# EAGLE design new_boardforfirebot (EAGLE 9.6.2)
AUTHOR: Brooks & Dorosk; BOARD_NAME: Final Board; DOC_NUM: 1; PROJECT_NAME: Fire Bot; REVISION: 2
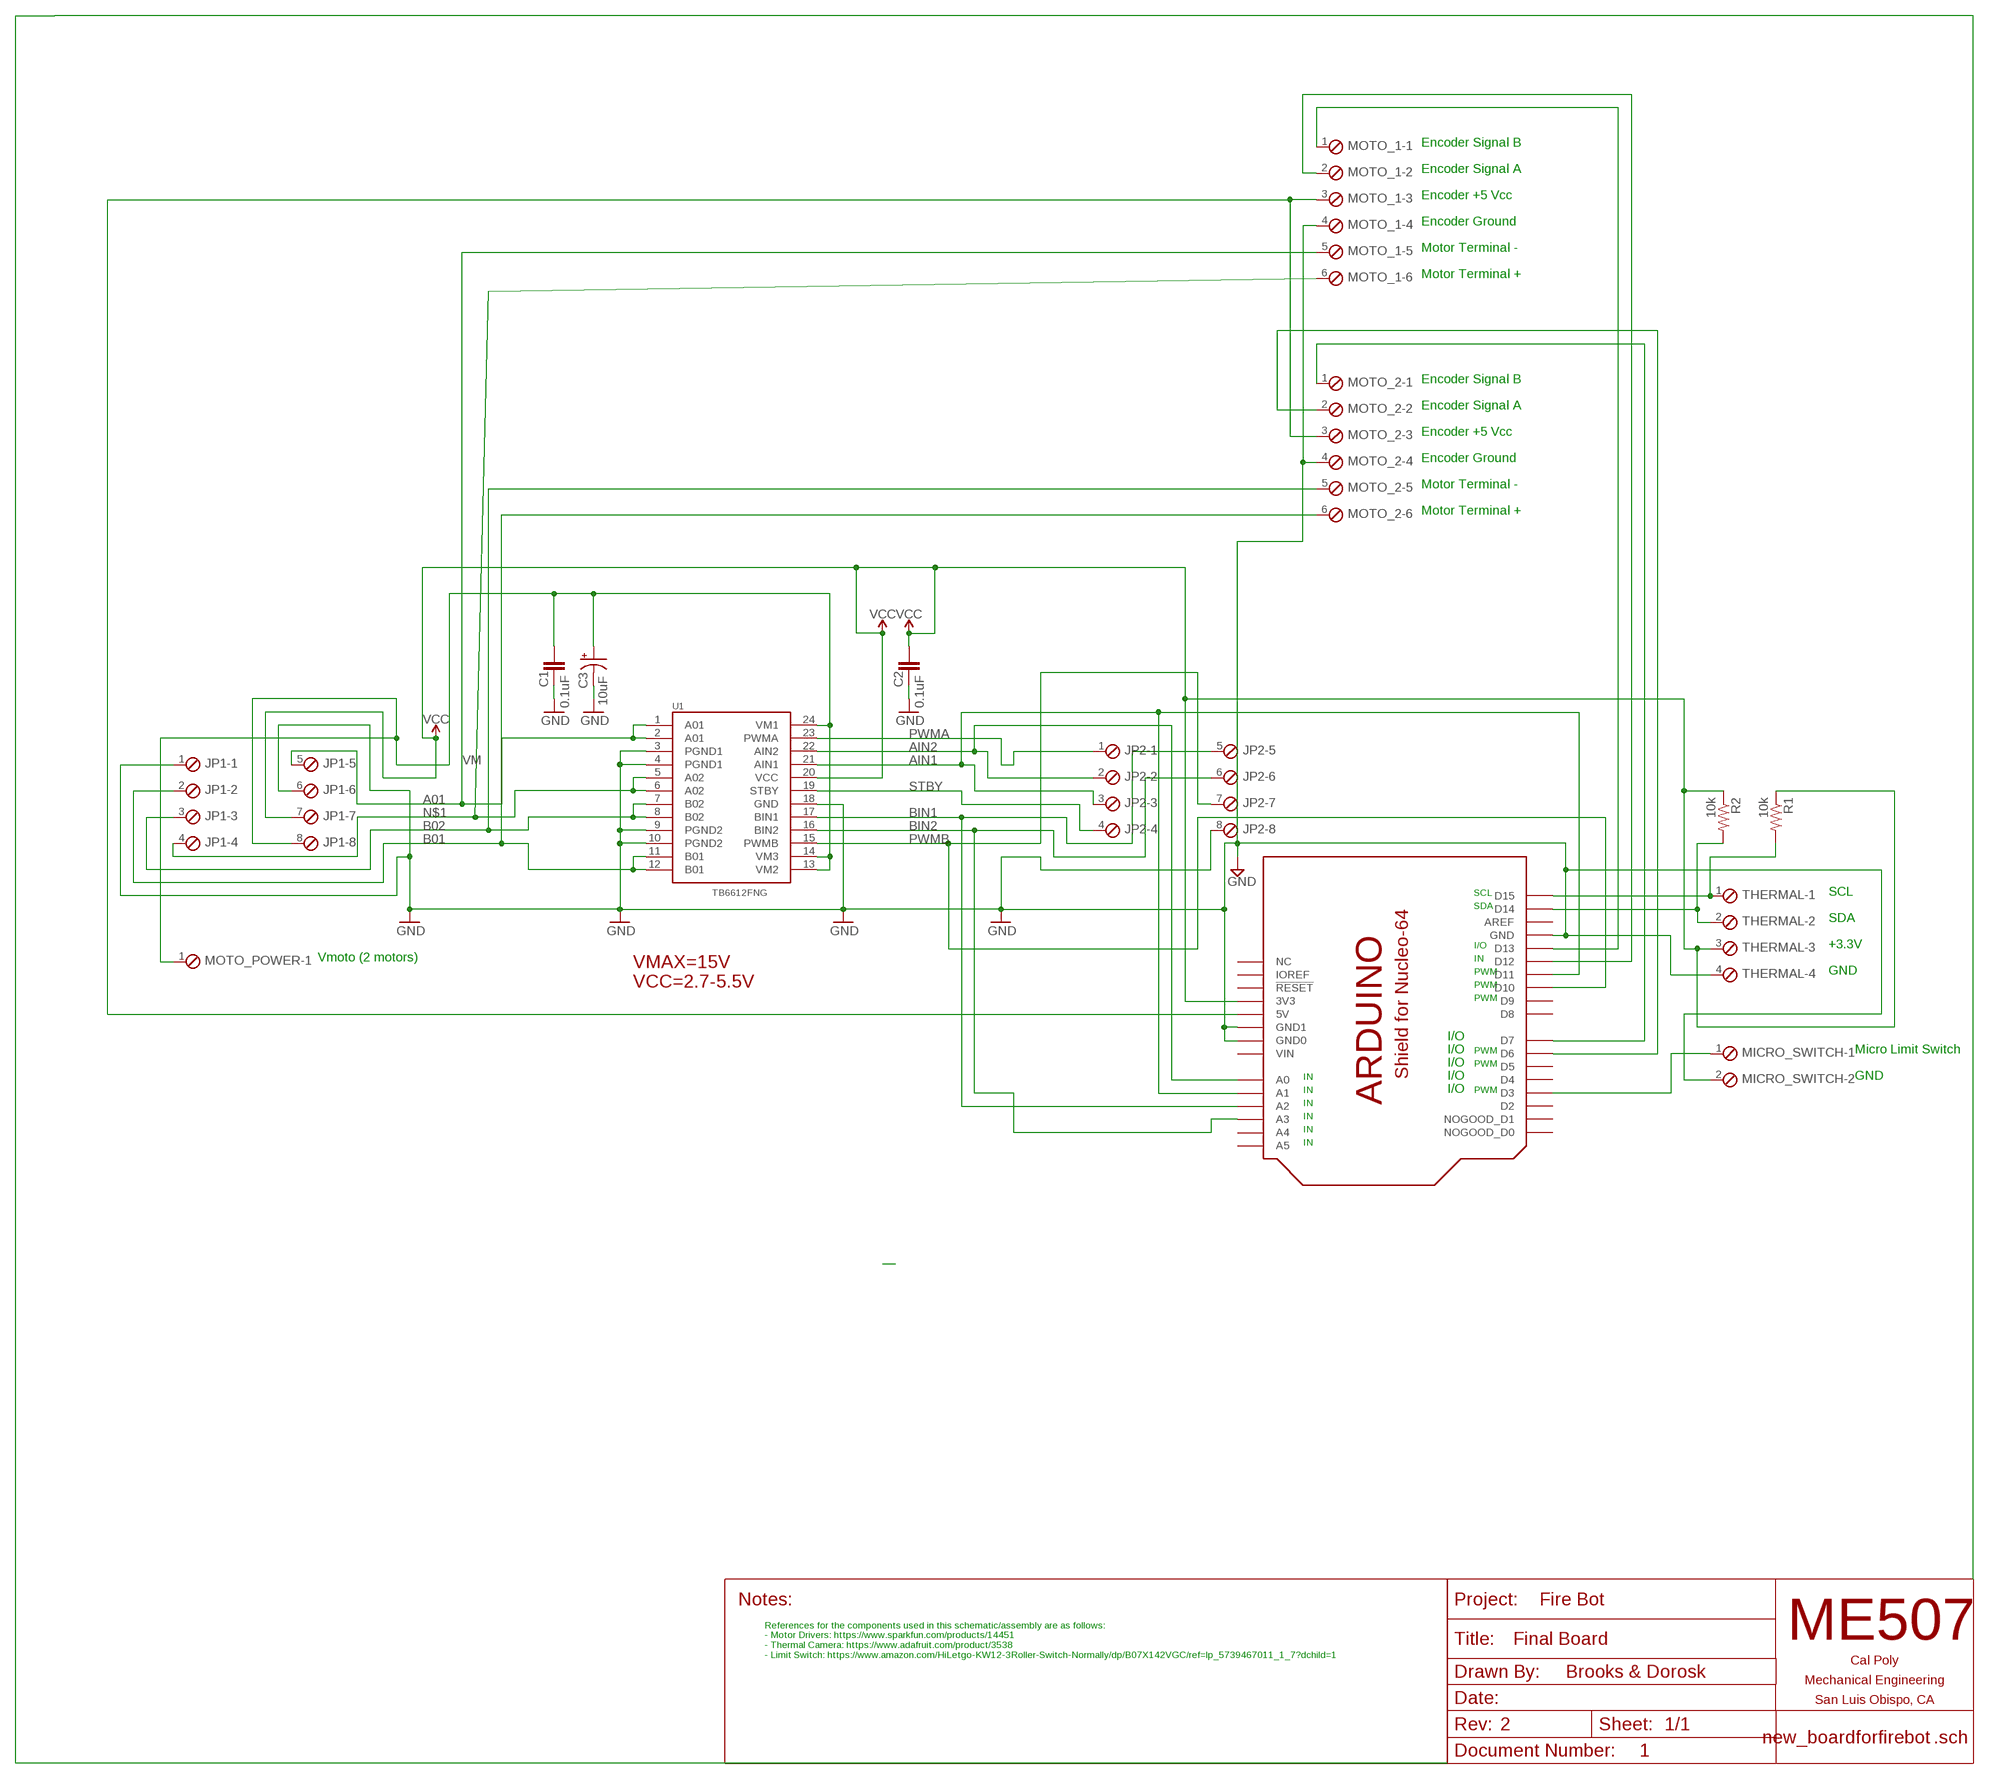
[diagram p0: schematic, sheet 1]

## Parts
C1  0.1uF  0.1UF-0402-16V-10%  [0402]
C2  0.1uF  0.1UF-0402-16V-10%  [0402]
C3  10uF  10UF-POLAR-EIA3528-20V-10%(TANT)  [EIA3528]
JP1  SCREWTERM_8P_254  [8POL254]
JP2  SCREWTERM_8P_254  [8POL254]
MICRO_SWITCH  SCREWTERM_2P_254  [2POL254]
MOTO_1  SCREWTERM_6P_254  [6POL254]
MOTO_2  SCREWTERM_6P_254  [6POL254]
MOTO_POWER  SCREWTERM_2P_254  [2POL254]
R1  10k  R-US_R0805  [R0805]
R2  10k  R-US_R0805  [R0805]
THERMAL  SCREWTERM_4P_254  [4POL254]
U1  TB6612FNG  [SSOP24]
U$1  SHIELD_FOR_NUCLE0_64_STANDARD  [SHIELD_FOR_NUCLEO_64_STD]

## Nets
A01: JP1.5 MOTO_1.5 U1.1(A01) U1.2(A01)
AIN1: JP2.3 U1.21(AIN1) U$1.A1 U$1.D11
AIN2: JP2.2 U1.22(AIN2) U$1.A0
B01: JP1.2 MOTO_2.6 U1.11(B01) U1.12(B01)
B02: JP1.3 MOTO_2.5 U1.7(B02) U1.8(B02)
BIN1: JP2.5 U1.17(BIN1) U$1.A2
BIN2: JP2.6 U1.16(BIN2) U$1.A3
GND: C1.2 C2.2 C3.C(-) JP1.1 JP1.6 JP2.8 MICRO_SWITCH.2 MOTO_1.4 MOTO_2.4 THERMAL.4 U1.3(PGND1) U1.4(PGND1) U1.9(PGND2) U1.10(PGND2) U1.18(GND) U$1.GND U$1.GND1(GND0) U$1.GND2(GND1)
N$1: JP1.4 MOTO_1.6 U1.5(A02) U1.6(A02)
N$3: MOTO_1.3 MOTO_2.3 U$1.5V
N$5: MOTO_1.1 U$1.D13
N$6: MOTO_1.2 U$1.D12
N$7: MOTO_2.1 U$1.D7
N$8: MOTO_2.2 U$1.D6
N$9: R1.2 THERMAL.1 U$1.D15
N$11: MICRO_SWITCH.1 U$1.D3
N$12: R2.2 THERMAL.2 U$1.D14
PWMA: JP2.1 U1.23(PWMA)
PWMB: JP2.7 U1.15(PWMB) U$1.D10
STBY: JP2.4 U1.19(STBY)
VCC: C2.1 JP1.7 R1.1 R2.1 THERMAL.3 U1.20(VCC) U$1.3V(3V3)
VM: C1.1 C3.A(+) JP1.8 MOTO_POWER.1 U1.13(VM2) U1.14(VM3) U1.24(VM1)
Unconnected: MOTO_POWER.2 U$1.A4 U$1.A5 U$1.AREF U$1.D0(NOGOOD_D0) U$1.D1(NOGOOD_D1) U$1.D2 U$1.D4 U$1.D5 U$1.D8 U$1.D9 U$1.IOREF U$1.NC U$1.NRST(!RESET)

## Notes on the sheet
- Encoder Signal B
- Encoder Signal A
- Encoder +5 Vcc
- Encoder Ground
- Motor Terminal -
- Motor Terminal +
- Encoder Signal B
- Encoder Signal A
- Encoder +5 Vcc
- Encoder Ground
- Motor Terminal -
- Motor Terminal +
- SCL | SCL
- SDA
- SDA
- I/O | +3.3V
- Vmoto (2 motors) | IN
- PWM | GND
- VMAX=15V
  VCC=2.7-5.5V
- PWM
- PWM
- I/O
- I/O | PWM | Micro Limit Switch
- I/O | PWM
- IN | I/O | GND
- IN | I/O | PWM
- IN
- IN
- IN
- IN
- References for the components used in this schematic/assembly are as follows:
  - Motor Drivers: https://www.sparkfun.com/products/14451
  - Thermal Camera: https://www.adafruit.com/product/3538
  - Limit Switch: https://www.amazon.com/HiLetgo-KW12-3Roller-Switch-Normally/dp/B07X142VGC/ref=lp_5739467011_1_7?dchild=1

## Power pins joined to a net without a drawn wire
VIN: U$1.VIN

## Library data of the parts
C1 C2 = SparkFun-Capacitors:0.1UF: 0.1µF ceramic capacitors A capacitor is a passive two-terminal electrical component used to store electrical energy temporarily in an electric field.; PROD_ID: CAP-12416
C3 = SparkFun-Capacitors:10UF-POLAR: 10.0µF polarized capacitors A capacitor is a passive two-terminal electrical component used to store electrical energy temporarily in an electric field.; PROD_ID: CAP-08063
JP1 JP2 = ME507:SCREWTERM_8P: Screw Terminal Block This part is designed for a screw terminal connector. The 2.54mm (0.100 inch) foorprint can also be used for male or female pin headers such as those on most development boards. One can also solder wires directly into the holes, though this makes modifications or repairs to the system more inconvenient. Larger versions can carry more current.
MICRO_SWITCH MOTO_POWER = ME507:SCREWTERM_2P: Screw Terminal Block This part is designed for a screw terminal connector. The 2.54mm (0.100 inch) foorprint can also be used for male or female pin headers such as those on most development boards. One can also solder wires directly into the holes, though this makes modifications or repairs to the system more inconvenient. Larger versions can carry more current.
MOTO_1 MOTO_2 = ME507:SCREWTERM_6P: Screw Terminal Block This part is designed for a screw terminal connector. The 2.54mm (0.100 inch) foorprint can also be used for male or female pin headers such as those on most development boards. One can also solder wires directly into the holes, though this makes modifications or repairs to the system more inconvenient. Larger versions can carry more current.
R1 R2 = rcl:R-US_: RESISTOR, American symbol; SPICEPREFIX: R
THERMAL = ME507:SCREWTERM_4P: Screw Terminal Block This part is designed for a screw terminal connector. The 2.54mm (0.100 inch) foorprint can also be used for male or female pin headers such as those on most development boards. One can also solder wires directly into the holes, though this makes modifications or repairs to the system more inconvenient. Larger versions can carry more current.
U1 = SparkFun-IC-Special-Function:TB6612FNG: Toshiba 1A dual motor driver IC-09363; PROD_ID: IC-09363
U$1 = ME507:SHIELD_FOR_NUCLE0_64: Arduino Style Shield for Nucleo-64 This is a board outline with pin locations for an Arduino style shield which fits on top of an STM32 Nucleo-64. Pin names are generic except for Nucleo specific pins such as IOREF. There are two board sizes, the standard which matches the size of an Arduino Uno, and the short version which can be less expensive to produce if you don't need a lot of board area. The outline is on the DIMENSION layer. When making a new board, you must delete the lines which form the default board outline so that this package's outlines control the dimensions of the board. Pins D0 and D1 are connected to a communications port and are not available for general use, so they are labeled as NOGOOD on the symbol and footprints.

## Board
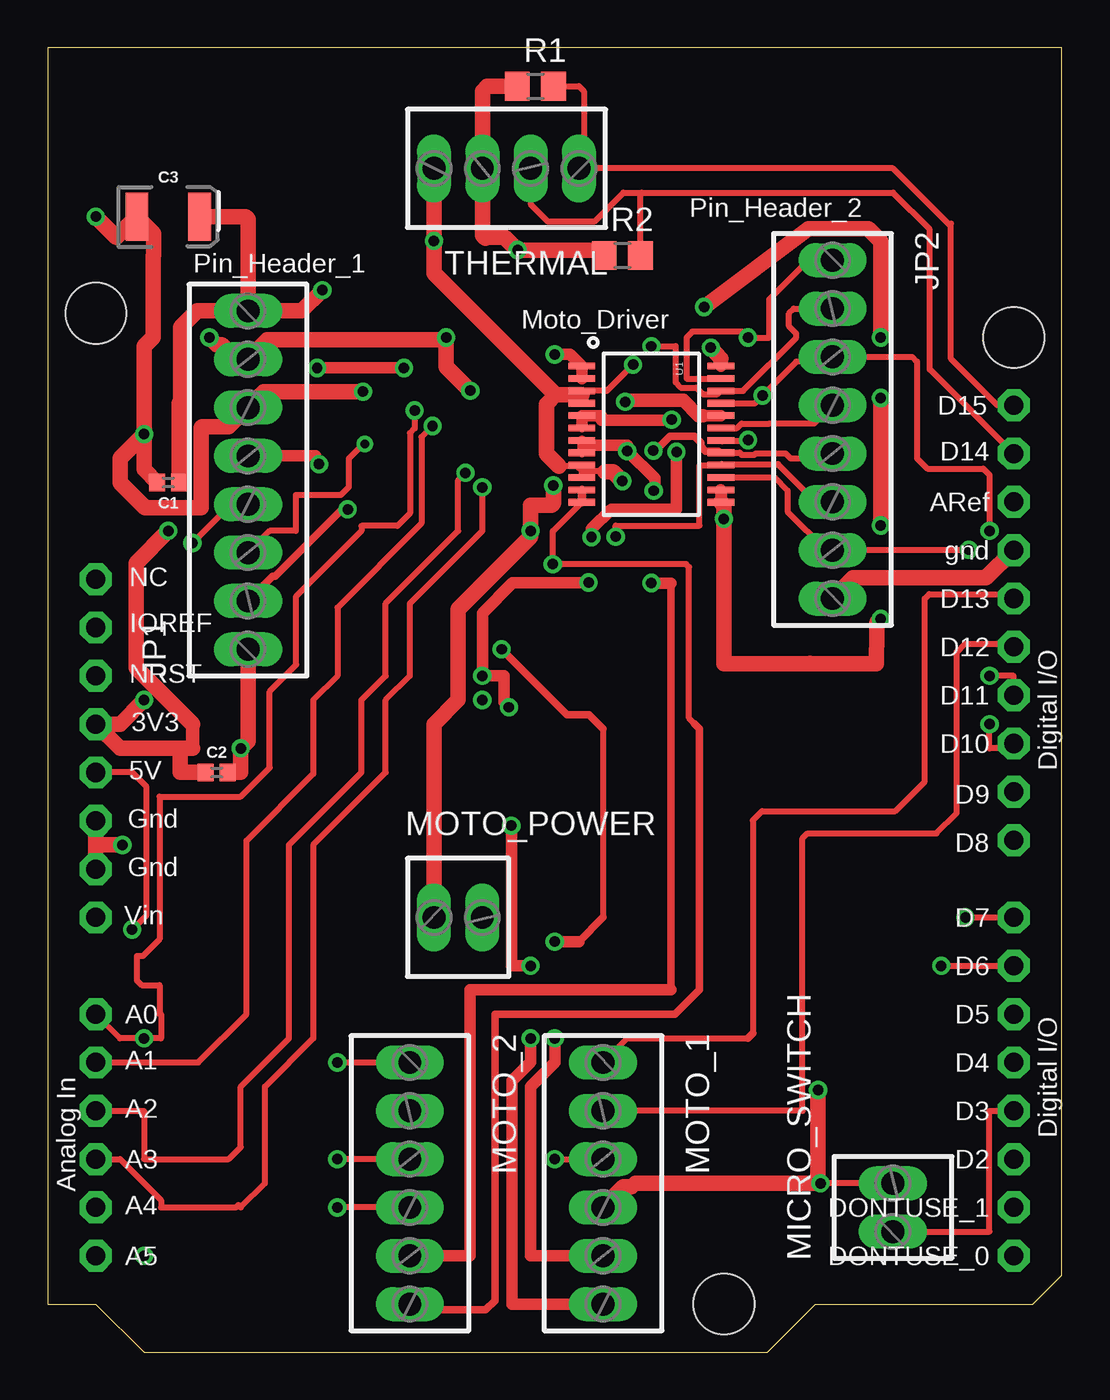
[diagram p1: board, top side]
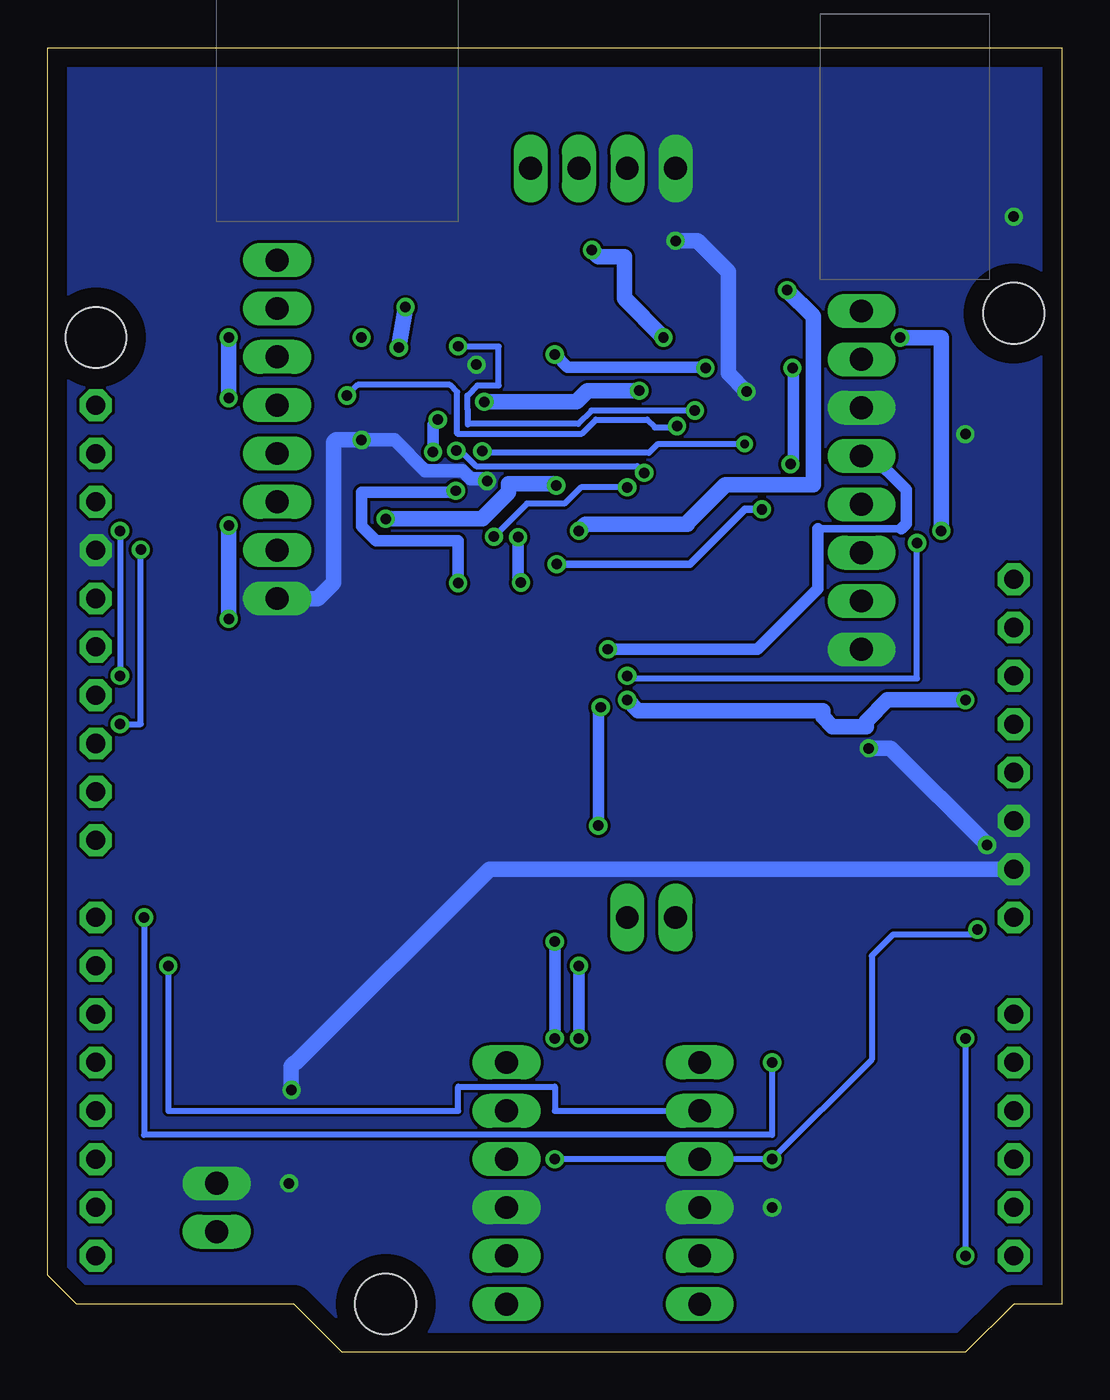
[diagram p2: board, bottom side, seen from below]

Size 53.34 x 68.58 mm. Coordinates in mm from the lower left corner, seen from the top.
Copper layers (1*16): Top 0.035mm / dielectric 1.5mm / Bottom 0.035mm
Design rules "default": minimum track width 6mil, minimum drill 0.35mm, track to track 6mil, track to pad 6mil, pad to pad 6mil, via to via 6mil, smd to smd 6mil, copper to edge 40mil, drill to drill 6mil, minimum pad ring 10mil, minimum via ring 8mil, stop-mask expansion 4mil, vias tented up to drill 0mil, thermal gap 10mil

### Footprints (pad centres in the part's own frame; a part is rotated, then mirrored left to right if it is on the bottom)
0402 = smd 0.85 x 0.9: 1 -0.58,0; 2 0.58,0
EIA3528 = smd 1.2 x 2.5: A 1.65,0; C -1.65,0
8POL254 = drill 1.2 long: 1 -8.89,0; 2 -6.35,0; 3 -3.81,0; 4 -1.27,0; 5 1.27,0; 6 3.81,0; 7 6.35,0; 8 8.89,0
2POL254 = drill 1.2 long: 1 -1.27,0; 2 1.27,0
6POL254 = drill 1.2 pad 1.778 long: 1 -6.35,0; 2 -3.81,0; 3 -1.27,0; 4 1.27,0; 5 3.81,0; 6 6.35,0
R0805 = smd 1.3 x 1.5: 1 -0.95,0; 2 0.95,0
4POL254 = drill 1.2 long: 1 -3.81,0; 2 -1.27,0; 3 1.27,0; 4 3.81,0
SSOP24 = smd 0.348 x 1.397: 1 -3.575,-3.656; 2 -2.925,-3.656; 3 -2.275,-3.656; 4 -1.625,-3.656; 5 -0.975,-3.656; 6 -0.325,-3.656; 7 0.325,-3.656; 8 0.975,-3.656; 9 1.625,-3.656; 10 2.275,-3.656; 11 2.925,-3.656; 12 3.575,-3.656; 13 3.575,3.656; 14 2.925,3.656; 15 2.275,3.656; 16 1.625,3.656; 17 0.975,3.656; 18 0.325,3.656; 19 -0.325,3.656; 20 -0.975,3.656; 21 -1.625,3.656; 22 -2.275,3.656; 23 -2.925,3.656; 24 -3.575,3.656
SHIELD_FOR_NUCLEO_64_STD = drill 1 pad 1.676 octagon: 3V 35.56,2.54; 5V 38.1,2.54; A0 50.8,2.54; A1 53.34,2.54; A2 55.88,2.54; A3 58.42,2.54; A4 60.96,2.54; A5 63.5,2.54; AREF 23.876,50.8; D0 63.5,50.8; D1 60.96,50.8; D2 58.42,50.8; D3 55.88,50.8; D4 53.34,50.8; D5 50.8,50.8; D6 48.26,50.8; D7 45.72,50.8; D8 41.656,50.8; D9 39.116,50.8; D10 36.576,50.8; D11 34.036,50.8; D12 31.496,50.8; D13 28.956,50.8; D14 21.336,50.8; D15 18.796,50.8; GND 26.416,50.8; GND1 43.18,2.54; GND2 40.64,2.54; IOREF 30.48,2.54; NC 27.94,2.54; NRST 33.02,2.54; VIN 45.72,2.54 | hole 3.2: 15.24,50.8; 66.04,35.56; 13.97,2.54

### Placement (x,y rotation side)
C1  6.35,45.72 180 top
C2  8.89,30.48 0 top
C3  6.35,59.69 0 top
JP1  10.54,45.85 90 top
JP2  41.27,48.51 270 top
MICRO_SWITCH  44.45,7.62 90 top
MOTO_1  29.21,8.89 270 top
MOTO_2  19.05,8.89 270 top
MOTO_POWER  21.59,22.86 0 top
R1  25.65,66.55 0 top
R2  30.23,57.66 0 top
THERMAL  24.13,62.23 180 top
U1  31.75,48.26 270 top
U$1  0,68.58 270 top

### Tracks (layer width: path | path; a pad name or v marks a point on that pad's centre or on a via)
A01  (via drill 0.55)
  Top 0.305: 14.1,47.12 14.1,46.99 | 29.21,32.77 29.21,22.86
  Top 0.406: v23.88,36.96 27.31,33.52 28.46,33.52 29.21,32.77 | 27.94,21.59 29.21,22.86
  Top 0.61: 14.1,46.99 14.28,46.81 v14.28,46.69 | MOTO_1.5 25.4,5.08 25.4,13.97 26.67,15.24 v26.67,16.51 | v26.67,21.59 27.94,21.59 | U1.2 U1.1 27.48,52.45 v26.67,52.45 | JP1.5 14.1,47.12 | v18.74,51.74 v14.17,51.74
  Bottom 0.305: v18.74,51.74 18.8,51.79
  Bottom 0.406: 12.83,43.3 8.46,43.3
  Bottom 0.61: v14.17,51.74 14.12,51.69 14.12,46.84 v14.28,46.69 | v26.67,52.45 26.01,51.79 19.87,51.79 18.8,51.79 | v26.67,16.51 v26.67,21.59 | v23.88,36.96 16,36.96 12.83,40.13 12.83,43.3 | 8.46,43.3 8.19,43.56 8.19,45.34 10.1,47.24 10.41,47.24 JP1.5
AIN1  (via drill 0.55)
  Top 0.305: v49.53,43.18 49.53,46.13 49.2,46.46 46.25,46.46 45.72,46.99 45.72,52.07 45.47,52.32 JP2.3 41.02,52.07 39.37,52.07 v37.59,50.29 37.19,49.88 U1.21 | U$1.D11 50.8,35.56 v49.53,35.56 | v20.24,48.69 19.66,48.11 19.66,43.57 15.24,39.15 15.24,35.56 13.97,34.29 13.97,30.4 10.46,26.9 10.46,17.78 7.93,15.24 U$1.A1
  Bottom 0.305: v49.53,43.18 v49.53,35.56 | v37.59,50.29 37.03,50.85 32.18,50.85 31.8,50.47 31.8,48.28 25.25,48.28 24.51,49.02 21.82,49.02 21.41,48.62 20.32,48.62 v20.24,48.69
AIN2  (via drill 0.55)
  Top 0.305: v31.75,52.88 33.02,52.88 33.02,50.98 33.29,50.71 34.11,50.71 34.44,50.39 34.44,50.36 35.23,50.36 U1.22 36.57,50.53 39.37,53.34 39.37,53.55 38.99,53.93 38.99,54.61 39.24,54.86 JP2.2 | v19.3,49.51 19.3,48.56 19.05,48.31 19.05,44.09 18.4,43.44 16.51,43.44 16.51,43.18 13.08,39.75 13.08,36.15 11.68,34.75 11.68,30.73 10.16,29.21 5.89,29.21 5.89,21.72 5,20.83 4.7,20.83 4.7,19.56 4.95,19.3 5.89,19.3 5.89,17.78 5.97,17.78 5.97,16.51 v5.08,16.51 3.81,16.51 U$1.A0
  Bottom 0.305: v19.3,49.51 24.74,49.51 25.45,48.8 31.21,48.8 31.24,48.77 31.24,49.57 31.26,49.59 31.26,50.29 30.73,50.82 29.62,50.82 29.62,52.86 31.72,52.86 v31.75,52.88 | v5.08,16.51 v5.08,5.08
B01  (via drill 0.55)
  Top 0.305: 34.01,33.05 33.73,33.33 33.73,41.27 33.58,41.43 v26.57,41.43 26.57,43.16 U1.12
  Top 0.406: 34.01,33.05 34.28,32.79 34.28,19.06 32.99,17.78 23.52,17.78 23.52,2.72 23.04,2.23 19.35,2.23 MOTO_2.6 | JP1.2 11.83,40.78 11.96,40.78 15.49,44.31 v15.78,44.31
  Top 0.457: U1.11 U1.12
  Bottom 0.406: v15.78,44.31 16.68,44.31 19.56,41.43 v26.57,41.43
B02  (via drill 0.46, 0.55)
  Top 0.305: JP1.3 11.68,43.18 13.06,43.18 13.06,45.06 15.42,45.06 15.85,45.49 15.85,46.99 16.61,47.75 v16.69,47.75
  Top 0.406: 32.77,40.44 32.77,19.05
  Top 0.508: U1.7 28.09,47.6 | 28.09,47.6 U1.8 | 28.09,47.6 28.17,47.67 28.36,47.67
  Top 0.61: MOTO_2.5 22.23,5.08 22.23,19.05 32.77,19.05 | 28.36,47.67 30.48,47.67 v30.48,47.37 30.51,47.37 31.93,45.95 31.93,45.29 v31.88,45.29 | v31.75,40.44 32.77,40.44
  Bottom 0.305: v16.69,47.75 21.24,47.75 21.72,47.27 30.38,47.27 v30.48,47.37
  Bottom 0.61: v31.88,45.29 31.95,45.21 36.83,45.21 36.83,43.43 36.07,42.67 31.75,42.67 v31.75,40.44
BIN1  (via drill 0.55)
  Top 0.152: U1.17 35.36,47.28 35.28,47.37
  Top 0.305: U$1.A2 5.08,12.7 5.08,10.16 9.53,10.16 10.16,10.79 10.16,13.97 12.7,16.51 12.7,26.67 16.51,30.48 16.51,34.29 17.78,35.56 17.78,39.37 21.59,43.18 21.59,45.85 v21.97,46.23 | U1.17 36.39,47.28 36.51,47.17 37.15,47.17 37.23,47.24 38.81,47.24 39.07,46.99 41.02,46.99 JP2.5
  Top 0.406: v31.85,47.4 31.95,47.4 32.72,48.16 34.01,48.16 34.35,47.82 34.35,47.61 34.6,47.37 35.28,47.37
  Bottom 0.305: v31.85,47.4 31.62,47.4 30.8,46.58 22.32,46.58 v21.97,46.23
BIN2  (via drill 0.55)
  Top 0.152: U1.16 35.46,46.69
  Top 0.305: U$1.A3 3.81,10.16 5.97,8 5.97,7.62 9.91,7.62 10.03,7.75 10.16,7.62 11.43,8.89 11.43,13.97 13.97,16.51 13.97,26.67 17.78,30.48 17.78,34.29 19.05,35.56 19.05,39.37 22.86,43.18 v22.86,45.47 | v29.87,42.88 29.87,43.46 34.29,43.46 34.29,46.63 U1.16 | 35.46,46.69 38.41,46.69 40.39,44.7 JP2.6
  Bottom 0.305: v22.86,45.47 25.3,45.47 26.16,44.6 28.14,44.6 v29.87,42.88
GND  (via drill 0.55)
  Top 0.305: MOTO_2.4 v15.24,7.62 | v36.83,47.95 36.75,47.88 35.46,47.88 U1.18 | MICRO_SWITCH.2 v40.64,8.89 | U1.4 28.09,50.32 U1.3 29.4,50.53 v30.79,51.92 | 16.6,50.48 v16.59,50.49 | U1.9 28.09,46.33 | U1.10 28.09,46.33 | 28.09,46.33 29.26,46.33 29.3,46.29 | 28.09,46.33 27.84,46.58 26.9,46.58
  Top 0.813: C1.2 5.08,46.41 v5.08,48.26 | v2.54,59.69 3.62,58.61 C3.C 5.59,58.8 5.59,57.66 5.56,57.63 5.56,53.36 5.08,52.88 v5.08,48.26 | v5.08,48.26 3.81,46.99 3.81,45.72 5.12,44.41 8.08,44.41 8.08,48.6 8.13,48.64 9.53,48.64 JP1.6 11.36,50.48 16.6,50.48 | C2.2 10.16,30.48 v10.16,31.75 10.54,32.13 JP1.1 | U$1.GND1 2.54,26.67 | 2.54,26.67 U$1.GND2 | 2.54,26.67 v3.94,26.67 | 26.72,50.32 20.32,56.72 v20.32,58.42 THERMAL.4 | 26.72,50.32 28.09,50.32 | JP2.8 42.36,40.7 49.34,40.7 U$1.GND | 26.72,50.32 26.24,49.84 26.24,47.24 26.9,46.58 | v30.23,45.8 29.73,46.29 29.3,46.29 | v40.51,13.79 40.51,9.02 v40.64,8.89 30.9,8.89 30.71,8.7 30.29,8.7 MOTO_1.4
  Bottom 0.711: v30.23,45.8 30.35,45.92 31.1,45.92 31.51,46.33 33.48,46.33 35.1,47.95 v36.83,47.95
  Bottom 0.813: v3.94,26.67 9.02,31.75 v10.16,31.75 | v16.59,50.49 17.55,51.46 17.55,56.79 19.18,58.42 v20.32,58.42 | JP2.8 39.14,39.62 38.3,40.46 38.3,47.83 38.18,47.95 v36.83,47.95 | U$1.GND1 30.1,25.4 40.28,15.21 40.36,15.21 40.54,15.04 40.54,13.79 v40.51,13.79
  pour Bottom (no thermals): 0,0 53.34,0 53.34,68.58 0,68.58
N$1  (via drill 0.55)
  Top 0.305: v7.62,42.55 9.65,44.58 JP1.4
  Top 0.457: U1.6 28.09,48.84
  Top 0.508: 29.13,49.23 29.12,49.23
  Top 0.61: MOTO_1.6 24.44,2.54 24.44,14.28 25.4,15.24 v25.4,16.51 | v32.82,49.02 32.85,48.99 29.13,48.99 29.13,49.23 | v28.6,42.85 28.6,43.28 29.64,44.32 33.07,44.32 v33.07,47.32 | v28.45,40.46 24.46,40.46 22.86,38.86 v22.86,35.56 24,35.56 24,34.16 v24.26,33.91 | v24.38,27.69 24.38,20.32 v25.4,20.32 | 29.12,49.23 U1.5 28.09,48.84
  Bottom 0.305: 28.6,40.62 v28.45,40.46 | v7.62,42.55 7.62,35.43 22.73,35.43 v22.86,35.56
  Bottom 0.61: v25.4,16.51 v25.4,20.32 | v32.82,49.02 33.07,48.77 v33.07,47.32 | v28.6,42.85 28.6,40.62 | v24.38,27.69 24.38,33.78 v24.26,33.91
N$3  (via drill 0.55)
  Top 0.305: MOTO_2.3 v15.24,10.16 | U$1.5V 4.45,30.48 5.21,29.72 5.21,22.99 v4.45,22.23 | v26.67,10.16 MOTO_1.3
  Bottom 0.305: v4.45,22.23 4.7,21.97 8.88,21.97 10.01,20.84 10.01,15.39 v15.24,10.16 v26.67,10.16
N$5
  Top 0.305: MOTO_1.1 30.48,16.51 36.83,16.51 | 37.08,16.76 37.08,27.96 37.57,28.45 44.58,28.45 46.13,30 46.13,39.62 46.36,39.86 50.57,39.86 U$1.D13
  Top 0.406: 37.08,16.76 36.83,16.51
N$6
  Top 0.305: MOTO_1.2 39.7,12.7 39.7,27.03 39.95,27.28 42.98,27.28 46.74,27.28 47.8,28.35 47.8,36.8 48.23,37.24 50.65,37.24 U$1.D12
N$7  (via drill 0.55)
  Top 0.305: v48.26,22.86 U$1.D7 | v15.24,15.24 MOTO_2.1
  Bottom 0.305: v48.26,22.86 48.26,11.43 15.24,11.43 v15.24,15.24
N$8  (via drill 0.55)
  Top 0.305: v46.99,20.32 U$1.D6
  Bottom 0.305: v46.99,20.32 46.99,12.7 31.75,12.7 31.75,13.97 26.67,13.97 26.67,12.7 MOTO_2.2
N$9
  Top 0.152: U$1.D15 49.94,49.78 | 47.5,59.33 47.42,59.26
  Top 0.305: 47.42,59.26 44.45,62.23 THERMAL.1 28.19,62.48 28.19,66.29 27.94,66.55 R1.2 | 49.94,49.78 47.5,52.22 47.5,59.33
N$11
  Top 0.305: MICRO_SWITCH.1 49.53,6.35 49.53,12.7 U$1.D3
N$12
  Top 0.305: U$1.D14 46.38,51.66 46.38,59.03 44.45,60.96 31.24,60.96 | THERMAL.2 25.4,60.35 26.31,59.44 28.75,59.44 30.28,60.96 31.24,60.96 | R2.2 31.18,60.89 31.24,60.96
PWMA  (via drill 0.55)
  Top 0.305: U1.23 33.6,51.19 33.6,53.34 33.91,53.65 36.52,53.65 v36.83,53.34 37.95,53.34 37.95,55.34 40.01,57.4 JP2.1
PWMB  (via drill 0.55)
  Top 0.305: v48.44,42.19 48.41,42.16 JP2.7 40.95,42.16 38.91,44.2 38.91,45.31 38.24,45.98 U1.15 | U$1.D10 50.55,31.75 49.53,31.75 v49.53,33.02
  Bottom 0.305: v48.44,42.19 48.44,33.02 v49.53,33.02
STBY
  Top 0.305: U1.19 36.26,48.59 36.49,48.82 37.95,48.82 40.31,48.82 JP2.4
VCC  (via drill 0.55)
  Top 0.305: C2.1 8,30.48
  Top 0.61: U1.20 34.47,49.23
  Top 0.711: v30.38,49.96 30.45,50.04 33.43,50.04 34.23,49.23 34.47,49.23 | 7.62,31.75 7.62,33.02
  Top 0.813: 6.98,31.75 3.81,31.75 U$1.3V 3.81,33.02 v5.08,34.29 | 6.98,31.75 7.62,31.75 | v6.35,43.18 4.65,41.48 4.65,35.99 7.62,33.02 | 6.98,31.75 6.98,30.48 8,30.48 | R1.1 23.11,66.55 22.86,66.29 THERMAL.3 22.86,58.73 23.04,58.55 23.11,58.62 24.03,58.62 v24.71,57.94 29,57.94 R2.1 | v8.51,53.34 8.89,52.96 9.14,52.96 9.91,52.2 JP1.7 11.56,53.21 19.62,53.21 19.64,53.23 20.85,53.23 v20.95,53.34 20.95,51.82 v22.23,50.55
  Bottom 0.813: v22.86,34.29 22.3,33.73 12.57,33.73 12.57,33.4 12.06,32.89 10.29,32.89 10.29,33.18 9.18,34.29 v5.08,34.29 | v20.95,53.34 23.01,55.4 23.01,57.58 24.36,57.58 v24.71,57.94 | v8.51,53.34 6.35,53.34 v6.35,43.18 | v22.23,50.55 24.94,50.55 25.53,49.96 v30.38,49.96
VM  (via drill 0.55)
  Top 0.61: U1.24 35.41,52.22
  Top 0.635: U1.14 U1.13
  Top 0.813: C1.1 6.93,49.88 7.01,49.96 7.01,53.87 7.87,54.74 JP1.8 | 35.41,52.22 v34.87,52.81 | v34.52,54.94 40.01,59.05 43.16,59.05 43.82,58.4 v43.82,53.34 | v43.82,50.16 v43.82,43.46 | v43.82,38.56 43.62,38.36 43.61,37.89 43.58,36.2 40.11,36.2 40.08,36.22 40.06,36.2 35.56,36.2 v35.56,43.81 35.56,44.53 U1.13 | v26.59,45.57 26.59,44.63 26.5,44.53 25.4,44.53 v25.4,43.18 25.4,42.88 21.59,39.06 21.59,34.29 20.32,33.02 MOTO_POWER.1 | v14.45,55.83 13.36,54.74 JP1.8 | C3.A 10.41,59.69 10.54,59.56 JP1.8
  Bottom 0.813: v26.59,45.57 26.67,45.64 29.11,45.64 29.11,45.22 30.48,43.85 30.48,43.81 v35.56,43.81 | v25.4,43.18 25.04,43.54 19.69,43.54 19.69,43.61 17.7,45.59 13.08,45.59 13.08,54.46 v14.45,55.83 | v34.52,54.94 v34.87,52.81 | v43.82,53.34 v43.82,50.16 | v43.82,43.46 v43.82,38.56

### Text on the board
tNames: Pin_Header_2 | Pin_Header_1 | Moto_Driver